# Altium schematic sheet [Archive] Connector Arrangement.SchDoc: [4] - CONNECTORS
size A4; Author: Sawyer Rempel; Revision: A
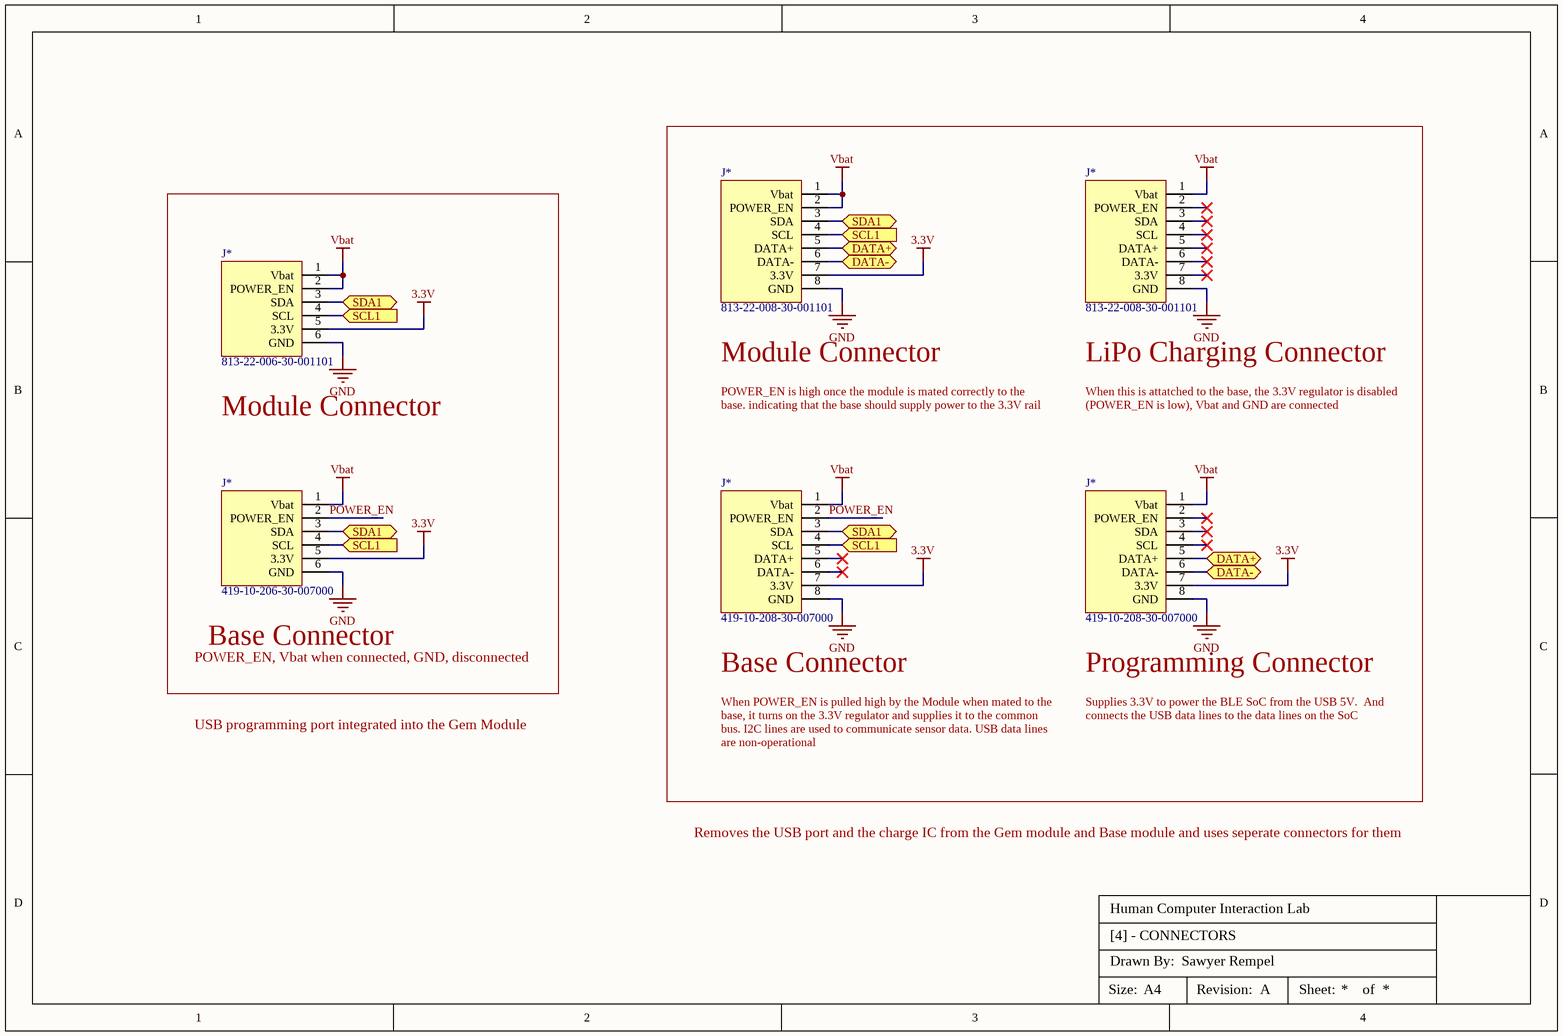
[diagram p0: [Archive] Connector Arrangement.SchDoc]

## Parts
(Parts that share a designator on the sheet are numbered #1, #2 ... from top to bottom, then left to right.)
J*#1  813-22-008-30-001101
J*#2  813-22-008-30-001101
J*#3  813-22-006-30-001101  [813-22-006-30-001101]
J*#4  419-10-206-30-007000  [419-10-206-30-007000]
J*#5  419-10-208-30-007000
J*#6  419-10-208-30-007000

## Ports
DATA+ (bidir), DATA- (bidir), SCL1 (in), SDA1 (bidir)

## Nets
3.3V: J*#1.7(3.3V) J*#3.5(3.3V) J*#4.5(3.3V) J*#5.7(3.3V) J*#6.7(3.3V)
GND: J*#1.8(GND) J*#2.8(GND) J*#3.6(GND) J*#4.6(GND) J*#5.8(GND) J*#6.8(GND)
Vbat: J*#1.1(Vbat) J*#1.2(POWER_EN) J*#2.1(Vbat) J*#3.1(Vbat) J*#3.2(POWER_EN) J*#4.1(Vbat) J*#5.1(Vbat) J*#6.1(Vbat)
DATA+: J*#1.5(DATA+) J*#6.5(DATA+) ; port DATA+
DATA-: J*#1.6(DATA-) J*#6.6(DATA-) ; port DATA-
POWER_EN: J*#4.2(POWER_EN) J*#5.2(POWER_EN)
SCL1: J*#1.4(SCL) J*#3.4(SCL) J*#4.4(SCL) J*#5.4(SCL) ; port SCL1
SDA1: J*#1.3(SDA) J*#3.3(SDA) J*#4.3(SDA) J*#5.3(SDA) ; port SDA1

Not connected (* = marked no-connect by the designer): J*#2 2(POWER_EN)* 3(SDA)* 4(SCL)* 5(DATA+)* 6(DATA-)* 7(3.3V)*; J*#5 5(DATA+)* 6(DATA-)*; J*#6 2(POWER_EN)* 3(SDA)* 4(SCL)*

## Notes on the sheet
- (near J*#1) Module Connector
- (near J*#2) LiPo Charging Connector
- (near J*#3) Module Connector
- (near J*#5) POWER_EN is high once the module is mated correctly to the base. indicating that the base should supply power to the 3.3V rail
- (near J*#6) When this is attatched to the base, the 3.3V regulator is disabled (POWER_EN is low), Vbat and GND are connected
- (near J*#4) Base Connector
- POWER_EN, Vbat when connected, GND, disconnected
- (near J*#5) Base Connector
- (near J*#6) Programming Connector
- USB programming port integrated into the Gem Module
- When POWER_EN is pulled high by the Module when mated to the base, it turns on the 3.3V regulator and supplies it to the common bus. I2C lines are used to communicate sensor data. USB data lines are non-operational
- Supplies 3.3V to power the BLE SoC from the USB 5V.  And connects the USB data lines to the data lines on the SoC
- Removes the USB port and the charge IC from the Gem module and Base module and uses seperate connectors for them
- Human Computer Interaction Lab
- Drawn By:
- Size:
- A4
- Revision:
- Sheet:
- of